# Altium schematic sheet 07_ZYNQ_CAMERALINK.SchDoc
size 420 x 296 mm; SheetNumber: 7; SheetTotal: 7
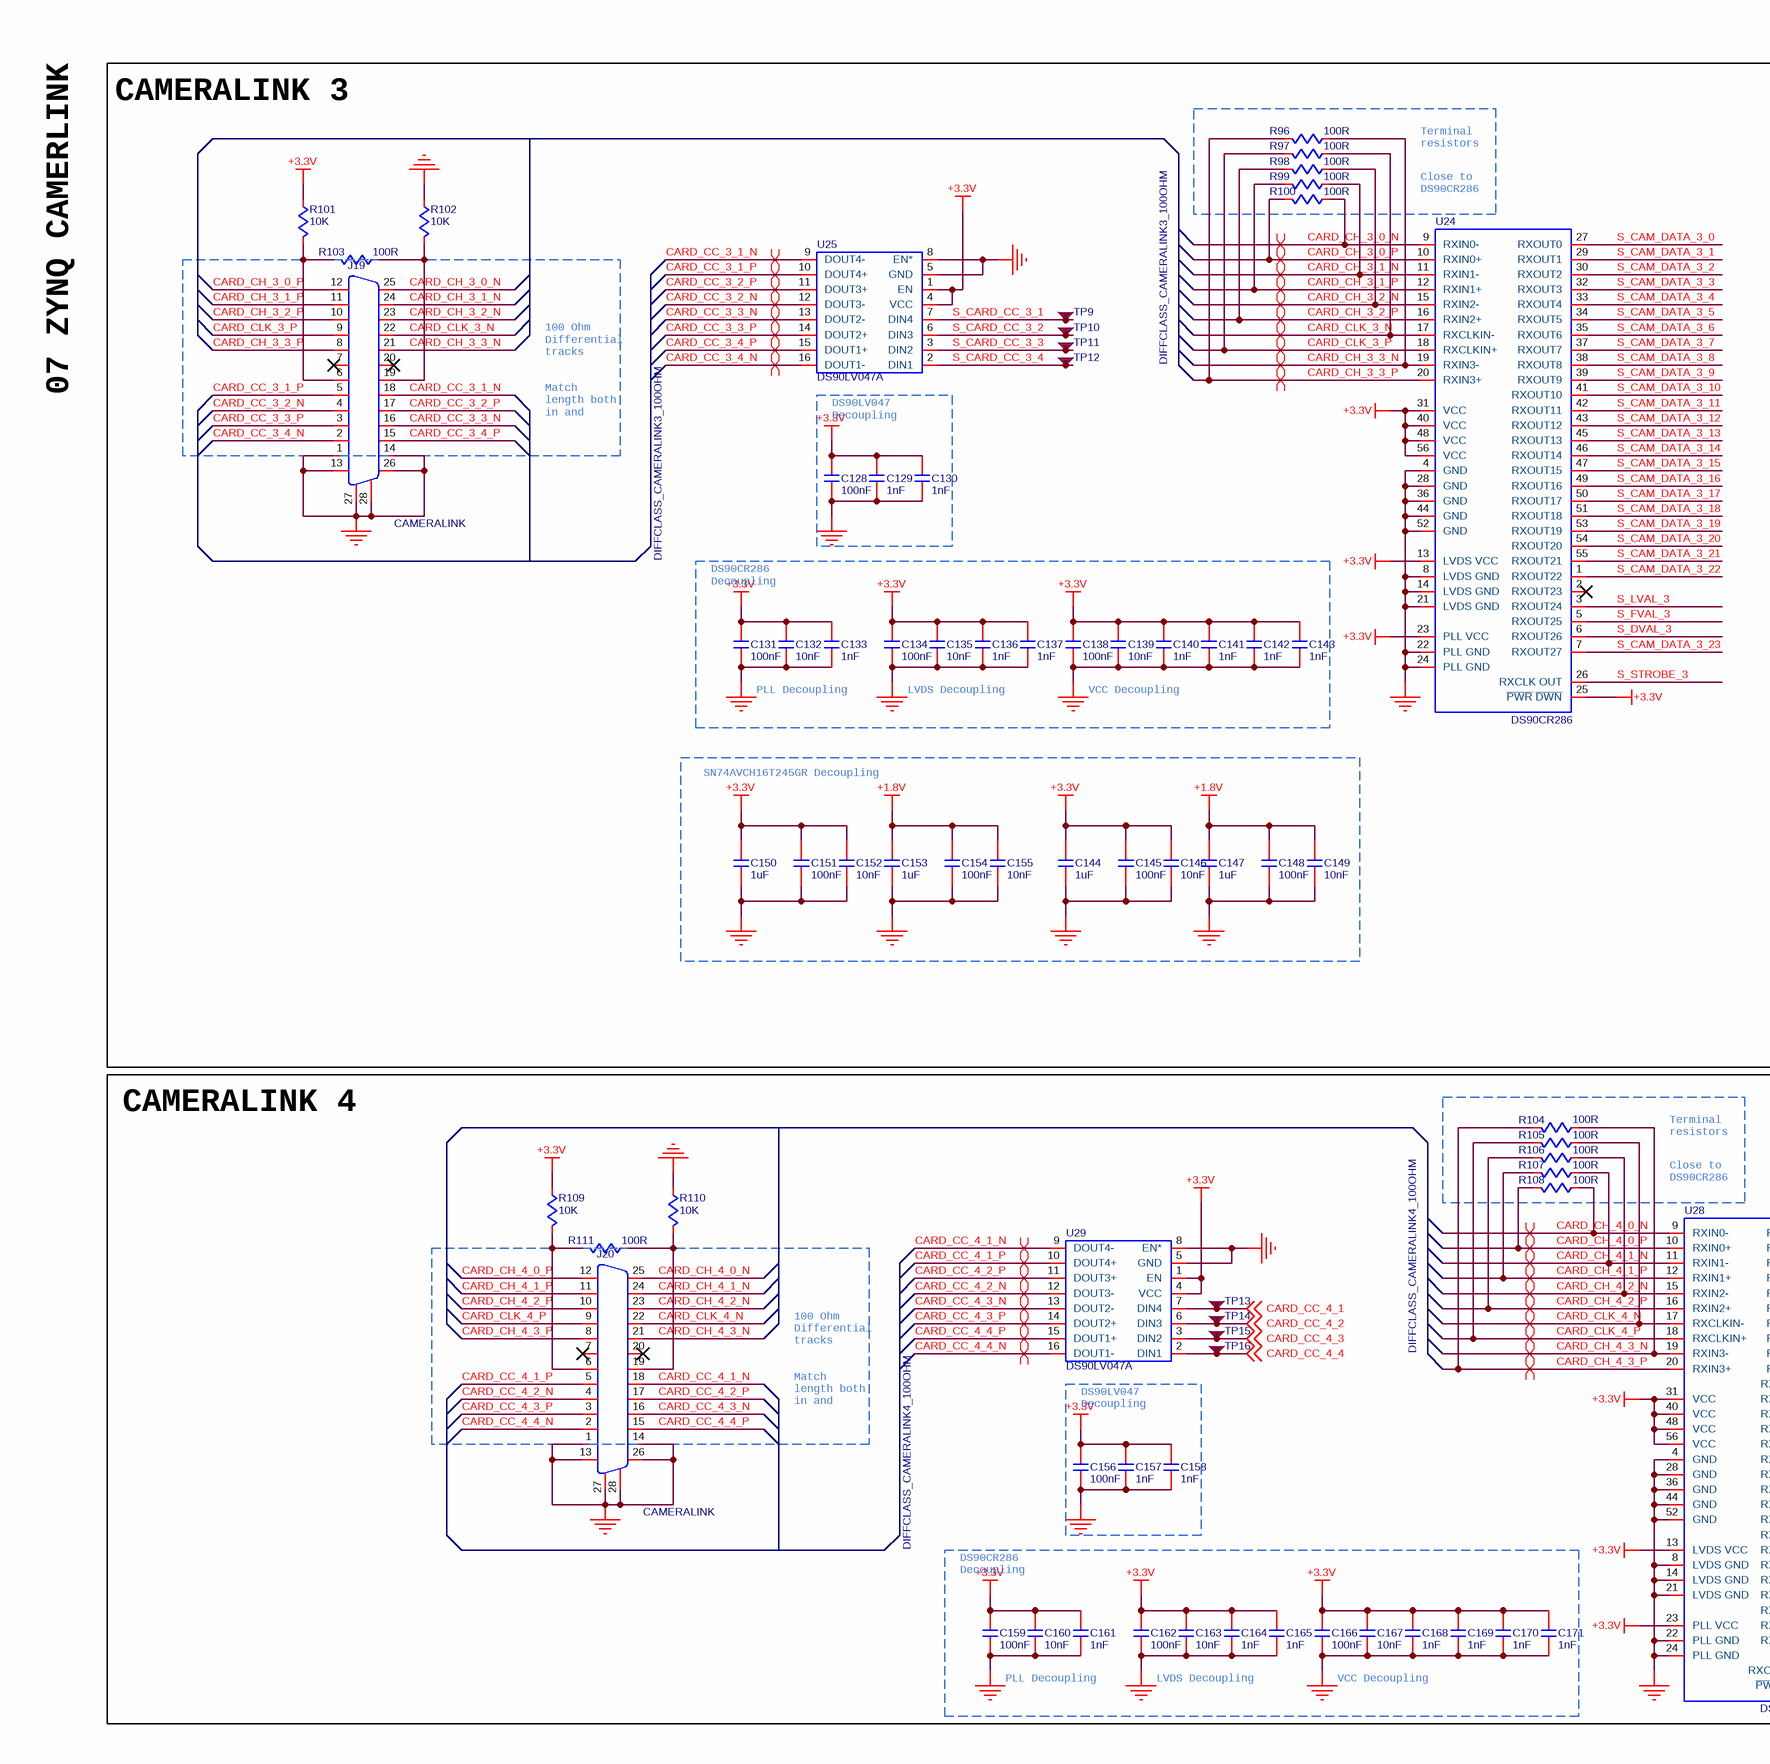
[diagram p0: 07_ZYNQ_CAMERALINK.SchDoc, left]
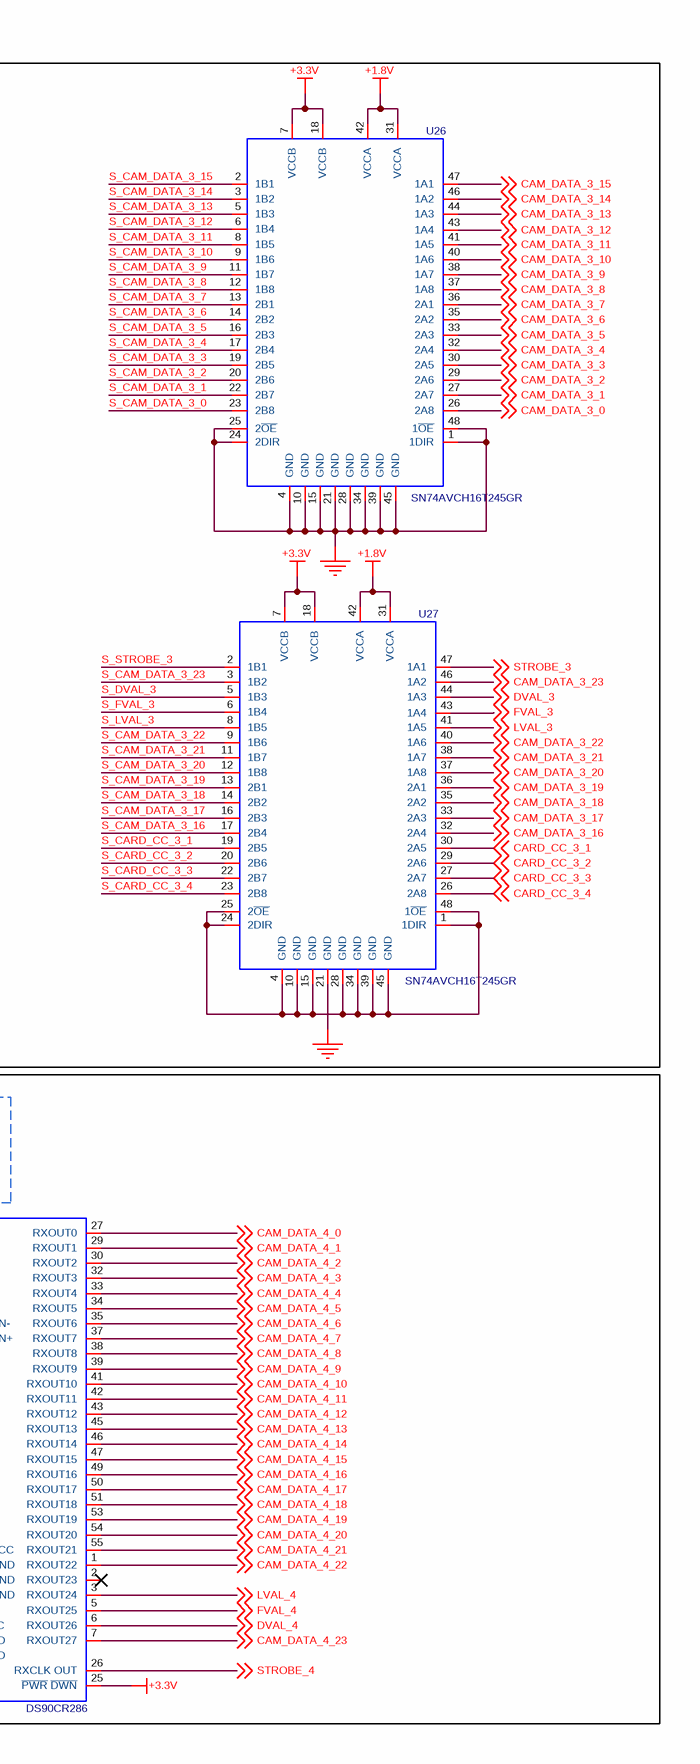
[diagram p1: 07_ZYNQ_CAMERALINK.SchDoc, right]

## Parts
C128  value 100nF  [C0402]  (hidden comment: C-NOMO)
C129  value 1nF  [C0402]  (hidden comment: C-NOMO)
C130  value 1nF  [C0402]  (hidden comment: C-NOMO)
C131  value 100nF  [C0402]  (hidden comment: C-NOMO)
C132  value 10nF  [C0402]  (hidden comment: C-NOMO)
C133  value 1nF  [C0402]  (hidden comment: C-NOMO)
C134  value 100nF  [C0402]  (hidden comment: C-NOMO)
C135  value 10nF  [C0402]  (hidden comment: C-NOMO)
C136  value 1nF  [C0402]  (hidden comment: C-NOMO)
C137  value 1nF  [C0402]  (hidden comment: C-NOMO)
C138  value 100nF  [C0402]  (hidden comment: C-NOMO)
C139  value 10nF  [C0402]  (hidden comment: C-NOMO)
C140  value 1nF  [C0402]  (hidden comment: C-NOMO)
C141  value 1nF  [C0402]  (hidden comment: C-NOMO)
C142  value 1nF  [C0402]  (hidden comment: C-NOMO)
C143  value 1nF  [C0402]  (hidden comment: C-NOMO)
C144  value 1uF  [C0402]  (hidden comment: C-NOMO)
C145  value 100nF  [C0402]  (hidden comment: C-NOMO)
C146  value 10nF  [C0402]  (hidden comment: C-NOMO)
C147  value 1uF  [C0402]  (hidden comment: C-NOMO)
C148  value 100nF  [C0402]  (hidden comment: C-NOMO)
C149  value 10nF  [C0402]  (hidden comment: C-NOMO)
C150  value 1uF  [C0402]  (hidden comment: C-NOMO)
C151  value 100nF  [C0402]  (hidden comment: C-NOMO)
C152  value 10nF  [C0402]  (hidden comment: C-NOMO)
C153  value 1uF  [C0402]  (hidden comment: C-NOMO)
C154  value 100nF  [C0402]  (hidden comment: C-NOMO)
C155  value 10nF  [C0402]  (hidden comment: C-NOMO)
C156  value 100nF  [C0402]  (hidden comment: C-NOMO)
C157  value 1nF  [C0402]  (hidden comment: C-NOMO)
C158  value 1nF  [C0402]  (hidden comment: C-NOMO)
C159  value 100nF  [C0402]  (hidden comment: C-NOMO)
C160  value 10nF  [C0402]  (hidden comment: C-NOMO)
C161  value 1nF  [C0402]  (hidden comment: C-NOMO)
C162  value 100nF  [C0402]  (hidden comment: C-NOMO)
C163  value 10nF  [C0402]  (hidden comment: C-NOMO)
C164  value 1nF  [C0402]  (hidden comment: C-NOMO)
C165  value 1nF  [C0402]  (hidden comment: C-NOMO)
C166  value 100nF  [C0402]  (hidden comment: C-NOMO)
C167  value 10nF  [C0402]  (hidden comment: C-NOMO)
C168  value 1nF  [C0402]  (hidden comment: C-NOMO)
C169  value 1nF  [C0402]  (hidden comment: C-NOMO)
C170  value 1nF  [C0402]  (hidden comment: C-NOMO)
C171  value 1nF  [C0402]  (hidden comment: C-NOMO)
J19  CAMERALINK  [CAMERALINK]
J20  CAMERALINK  [CAMERALINK]
R96  value 100R  [R0402]  (hidden comment: R)
R97  value 100R  [R0402]  (hidden comment: R)
R98  value 100R  [R0402]  (hidden comment: R)
R99  value 100R  [R0402]  (hidden comment: R)
R100  value 100R  [R0402]  (hidden comment: R)
R101  value 10K  [R0402]  (hidden comment: R)
R102  value 10K  [R0402]  (hidden comment: R)
R103  value 100R  [R0402]  (hidden comment: R)
R104  value 100R  [R0402]  (hidden comment: R)
R105  value 100R  [R0402]  (hidden comment: R)
R106  value 100R  [R0402]  (hidden comment: R)
R107  value 100R  [R0402]  (hidden comment: R)
R108  value 100R  [R0402]  (hidden comment: R)
R109  value 10K  [R0402]  (hidden comment: R)
R110  value 10K  [R0402]  (hidden comment: R)
R111  value 100R  [R0402]  (hidden comment: R)
TP9  TP  [TP]  (value not drawn)
TP10  TP  [TP]  (value not drawn)
TP11  TP  [TP]  (value not drawn)
TP12  TP  [TP]  (value not drawn)
TP13  TP  [TP]  (value not drawn)
TP14  TP  [TP]  (value not drawn)
TP15  TP  [TP]  (value not drawn)
TP16  TP  [TP]  (value not drawn)
U24  DS90CR286  [DS90CR286]
U25  DS90LV047A  [DS90LV047]
U26  SN74AVCH16T245GR  [SN74AVCH16T245GR]
U27  SN74AVCH16T245GR  [SN74AVCH16T245GR]
U28  DS90CR286  [DS90CR286]
U29  DS90LV047A  [DS90LV047]

## Blocks framed on the sheet
CAMERALINK 3: C128-C155 J19 R96-R103 TP9-TP12 U24-U27
CAMERALINK 4: C156-C171 J20 R104-R111 TP13-TP16 U28 U29

## Nets
+1.8V: C147.2 C148.2 C149.2 C153.2 C154.2 C155.2 U26.31(VCCA) U26.42(VCCA) U27.31(VCCA) U27.42(VCCA)
+3.3V: C128.2 C129.2 C130.2 C131.2 C132.2 C133.2 C134.2 C135.2 C136.2 C137.2 C138.2 C139.2 C140.2 C141.2 C142.2 C143.2 C144.2 C145.2 C146.2 C150.2 C151.2 C152.2 C156.2 C157.2 C158.2 C159.2 C160.2 C161.2 C162.2 C163.2 C164.2 C165.2 C166.2 C167.2 C168.2 C169.2 C170.2 C171.2 R101.2 R109.2 U24.13(LVDS_VCC) U24.23(PLL_VCC) U24.25(~{PWR}_~{DWN}) U24.31(VCC) U24.40(VCC) U24.48(VCC) U24.56(VCC) U25.1(EN) U25.4(VCC) U26.7(VCCB) U26.18(VCCB) U27.7(VCCB) U27.18(VCCB) U28.13(LVDS_VCC) U28.23(PLL_VCC) U28.25(~{PWR}_~{DWN}) U28.31(VCC) U28.40(VCC) U28.48(VCC) U28.56(VCC) U29.1(EN) U29.4(VCC)
GND: C128.1 C129.1 C130.1 C131.1 C132.1 C133.1 C134.1 C135.1 C136.1 C137.1 C138.1 C139.1 C140.1 C141.1 C142.1 C143.1 C144.1 C145.1 C146.1 C147.1 C148.1 C149.1 C150.1 C151.1 C152.1 C153.1 C154.1 C155.1 C156.1 C157.1 C158.1 C159.1 C160.1 C161.1 C162.1 C163.1 C164.1 C165.1 C166.1 C167.1 C168.1 C169.1 C170.1 C171.1 J19.1 J19.13 J19.14 J19.26 J19.27 J19.28 J20.1 J20.13 J20.14 J20.26 J20.27 J20.28 R102.2 R110.2 U24.4(GND) U24.8(LVDS_GND) U24.14(LVDS_GND) U24.21(LVDS_GND) U24.22(PLL_GND) U24.24(PLL_GND) U24.28(GND) U24.36(GND) U24.44(GND) U24.52(GND) U25.5(GND) U25.8(EN*) U26.1(1DIR) U26.4(GND) U26.10(GND) U26.15(GND) U26.21(GND) U26.24(2DIR) U26.25(2~{OE}) U26.28(GND) U26.34(GND) U26.39(GND) U26.45(GND) U26.48(1~{OE}) U27.21(GND) U28.4(GND) U28.8(LVDS_GND) U28.14(LVDS_GND) U28.21(LVDS_GND) U28.22(PLL_GND) U28.24(PLL_GND) U28.28(GND) U28.36(GND) U28.44(GND) U28.52(GND) U29.5(GND) U29.8(EN*)
CAM_DATA_3_0: U26.26(2A8) ; off-sheet CAM_DATA_3_0
CAM_DATA_3_1: U26.27(2A7) ; off-sheet CAM_DATA_3_1
CAM_DATA_3_2: U26.29(2A6) ; off-sheet CAM_DATA_3_2
CAM_DATA_3_3: U26.30(2A5) ; off-sheet CAM_DATA_3_3
CAM_DATA_3_4: U26.32(2A4) ; off-sheet CAM_DATA_3_4
CAM_DATA_3_5: U26.33(2A3) ; off-sheet CAM_DATA_3_5
CAM_DATA_3_6: U26.35(2A2) ; off-sheet CAM_DATA_3_6
CAM_DATA_3_7: U26.36(2A1) ; off-sheet CAM_DATA_3_7
CAM_DATA_3_8: U26.37(1A8) ; off-sheet CAM_DATA_3_8
CAM_DATA_3_9: U26.38(1A7) ; off-sheet CAM_DATA_3_9
CAM_DATA_3_10: U26.40(1A6) ; off-sheet CAM_DATA_3_10
CAM_DATA_3_11: U26.41(1A5) ; off-sheet CAM_DATA_3_11
CAM_DATA_3_12: U26.43(1A4) ; off-sheet CAM_DATA_3_12
CAM_DATA_3_13: U26.44(1A3) ; off-sheet CAM_DATA_3_13
CAM_DATA_3_14: U26.46(1A2) ; off-sheet CAM_DATA_3_14
CAM_DATA_3_15: U26.47(1A1) ; off-sheet CAM_DATA_3_15
CAM_DATA_3_16: U27.32(2A4) ; off-sheet CAM_DATA_3_16
CAM_DATA_3_17: U27.33(2A3) ; off-sheet CAM_DATA_3_17
CAM_DATA_3_18: U27.35(2A2) ; off-sheet CAM_DATA_3_18
CAM_DATA_3_19: U27.36(2A1) ; off-sheet CAM_DATA_3_19
CAM_DATA_3_20: U27.37(1A8) ; off-sheet CAM_DATA_3_20
CAM_DATA_3_21: U27.38(1A7) ; off-sheet CAM_DATA_3_21
CAM_DATA_3_22: U27.40(1A6) ; off-sheet CAM_DATA_3_22
CAM_DATA_3_23: U27.46(1A2) ; off-sheet CAM_DATA_3_23
CAM_DATA_4_0: U28.27(RXOUT0) ; off-sheet CAM_DATA_4_0
CAM_DATA_4_1: U28.29(RXOUT1) ; off-sheet CAM_DATA_4_1
CAM_DATA_4_2: U28.30(RXOUT2) ; off-sheet CAM_DATA_4_2
CAM_DATA_4_3: U28.32(RXOUT3) ; off-sheet CAM_DATA_4_3
CAM_DATA_4_4: U28.33(RXOUT4) ; off-sheet CAM_DATA_4_4
CAM_DATA_4_5: U28.34(RXOUT5) ; off-sheet CAM_DATA_4_5
CAM_DATA_4_6: U28.35(RXOUT6) ; off-sheet CAM_DATA_4_6
CAM_DATA_4_7: U28.37(RXOUT7) ; off-sheet CAM_DATA_4_7
CAM_DATA_4_8: U28.38(RXOUT8) ; off-sheet CAM_DATA_4_8
CAM_DATA_4_9: U28.39(RXOUT9) ; off-sheet CAM_DATA_4_9
CAM_DATA_4_10: U28.41(RXOUT10) ; off-sheet CAM_DATA_4_10
CAM_DATA_4_11: U28.42(RXOUT11) ; off-sheet CAM_DATA_4_11
CAM_DATA_4_12: U28.43(RXOUT12) ; off-sheet CAM_DATA_4_12
CAM_DATA_4_13: U28.45(RXOUT13) ; off-sheet CAM_DATA_4_13
CAM_DATA_4_14: U28.46(RXOUT14) ; off-sheet CAM_DATA_4_14
CAM_DATA_4_15: U28.47(RXOUT15) ; off-sheet CAM_DATA_4_15
CAM_DATA_4_16: U28.49(RXOUT16) ; off-sheet CAM_DATA_4_16
CAM_DATA_4_17: U28.50(RXOUT17) ; off-sheet CAM_DATA_4_17
CAM_DATA_4_18: U28.51(RXOUT18) ; off-sheet CAM_DATA_4_18
CAM_DATA_4_19: U28.53(RXOUT19) ; off-sheet CAM_DATA_4_19
CAM_DATA_4_20: U28.54(RXOUT20) ; off-sheet CAM_DATA_4_20
CAM_DATA_4_21: U28.55(RXOUT21) ; off-sheet CAM_DATA_4_21
CAM_DATA_4_22: U28.1(RXOUT22) ; off-sheet CAM_DATA_4_22
CAM_DATA_4_23: U28.7(RXOUT27) ; off-sheet CAM_DATA_4_23
CARD_CC_3_1: U27.30(2A5) ; off-sheet CARD_CC_3_1
CARD_CC_3_1_N: J19.18 U25.9(DOUT4-)
CARD_CC_3_1_P: J19.5 U25.10(DOUT4+)
CARD_CC_3_2: U27.29(2A6) ; off-sheet CARD_CC_3_2
CARD_CC_3_2_N: J19.4 U25.12(DOUT3-)
CARD_CC_3_2_P: J19.17 U25.11(DOUT3+)
CARD_CC_3_3: U27.27(2A7) ; off-sheet CARD_CC_3_3
CARD_CC_3_3_N: J19.16 U25.13(DOUT2-)
CARD_CC_3_3_P: J19.3 U25.14(DOUT2+)
CARD_CC_3_4: U27.26(2A8) ; off-sheet CARD_CC_3_4
CARD_CC_3_4_N: J19.2 U25.16(DOUT1-)
CARD_CC_3_4_P: J19.15 U25.15(DOUT1+)
CARD_CC_4_1: TP13.0 U29.7(DIN4) ; off-sheet CARD_CC_4_1
CARD_CC_4_1_N: J20.18 U29.9(DOUT4-)
CARD_CC_4_1_P: J20.5 U29.10(DOUT4+)
CARD_CC_4_2: TP14.0 U29.6(DIN3) ; off-sheet CARD_CC_4_2
CARD_CC_4_2_N: J20.4 U29.12(DOUT3-)
CARD_CC_4_2_P: J20.17 U29.11(DOUT3+)
CARD_CC_4_3: TP15.0 U29.3(DIN2) ; off-sheet CARD_CC_4_3
CARD_CC_4_3_N: J20.16 U29.13(DOUT2-)
CARD_CC_4_3_P: J20.3 U29.14(DOUT2+)
CARD_CC_4_4: TP16.0 U29.2(DIN1) ; off-sheet CARD_CC_4_4
CARD_CC_4_4_N: J20.2 U29.16(DOUT1-)
CARD_CC_4_4_P: J20.15 U29.15(DOUT1+)
CARD_CH_3_0_N: J19.25 R100.2 U24.9(RXIN0-)
CARD_CH_3_0_P: J19.12 R100.1 U24.10(RXIN0+)
CARD_CH_3_1_N: J19.24 R99.2 U24.11(RXIN1-)
CARD_CH_3_1_P: J19.11 R99.1 U24.12(RXIN1+)
CARD_CH_3_2_N: J19.23 R98.2 U24.15(RXIN2-)
CARD_CH_3_2_P: J19.10 R98.1 U24.16(RXIN2+)
CARD_CH_3_3_N: J19.21 R96.2 U24.19(RXIN3-)
CARD_CH_3_3_P: J19.8 R96.1 U24.20(RXIN3+)
CARD_CH_4_0_N: J20.25 R108.2 U28.9(RXIN0-)
CARD_CH_4_0_P: J20.12 R108.1 U28.10(RXIN0+)
CARD_CH_4_1_N: J20.24 R107.2 U28.11(RXIN1-)
CARD_CH_4_1_P: J20.11 R107.1 U28.12(RXIN1+)
CARD_CH_4_2_N: J20.23 R106.2 U28.15(RXIN2-)
CARD_CH_4_2_P: J20.10 R106.1 U28.16(RXIN2+)
CARD_CH_4_3_N: J20.21 R104.2 U28.19(RXIN3-)
CARD_CH_4_3_P: J20.8 R104.1 U28.20(RXIN3+)
CARD_CLK_3_N: J19.22 R97.2 U24.17(RXCLKIN-)
CARD_CLK_3_P: J19.9 R97.1 U24.18(RXCLKIN+)
CARD_CLK_4_N: J20.22 R105.2 U28.17(RXCLKIN-)
CARD_CLK_4_P: J20.9 R105.1 U28.18(RXCLKIN+)
DVAL_3: U27.44(1A3) ; off-sheet DVAL_3
DVAL_4: U28.6(RXOUT26) ; off-sheet DVAL_4
FVAL_3: U27.43(1A4) ; off-sheet FVAL_3
FVAL_4: U28.5(RXOUT25) ; off-sheet FVAL_4
LVAL_3: U27.41(1A5) ; off-sheet LVAL_3
LVAL_4: U28.3(RXOUT24) ; off-sheet LVAL_4
S_CAM_DATA_3_0: U24.27(RXOUT0) U26.23(2B8)
S_CAM_DATA_3_1: U24.29(RXOUT1) U26.22(2B7)
S_CAM_DATA_3_2: U24.30(RXOUT2) U26.20(2B6)
S_CAM_DATA_3_3: U24.32(RXOUT3) U26.19(2B5)
S_CAM_DATA_3_4: U24.33(RXOUT4) U26.17(2B4)
S_CAM_DATA_3_5: U24.34(RXOUT5) U26.16(2B3)
S_CAM_DATA_3_6: U24.35(RXOUT6) U26.14(2B2)
S_CAM_DATA_3_7: U24.37(RXOUT7) U26.13(2B1)
S_CAM_DATA_3_8: U24.38(RXOUT8) U26.12(1B8)
S_CAM_DATA_3_9: U24.39(RXOUT9) U26.11(1B7)
S_CAM_DATA_3_10: U24.41(RXOUT10) U26.9(1B6)
S_CAM_DATA_3_11: U24.42(RXOUT11) U26.8(1B5)
S_CAM_DATA_3_12: U24.43(RXOUT12) U26.6(1B4)
S_CAM_DATA_3_13: U24.45(RXOUT13) U26.5(1B3)
S_CAM_DATA_3_14: U24.46(RXOUT14) U26.3(1B2)
S_CAM_DATA_3_15: U24.47(RXOUT15) U26.2(1B1)
S_CAM_DATA_3_16: U24.49(RXOUT16) U27.17(2B4)
S_CAM_DATA_3_17: U24.50(RXOUT17) U27.16(2B3)
S_CAM_DATA_3_18: U24.51(RXOUT18) U27.14(2B2)
S_CAM_DATA_3_19: U24.53(RXOUT19) U27.13(2B1)
S_CAM_DATA_3_20: U24.54(RXOUT20) U27.12(1B8)
S_CAM_DATA_3_21: U24.55(RXOUT21) U27.11(1B7)
S_CAM_DATA_3_22: U24.1(RXOUT22) U27.9(1B6)
S_CAM_DATA_3_23: U24.7(RXOUT27) U27.3(1B2)
S_CARD_CC_3_1: TP9.0 U25.7(DIN4) U27.19(2B5)
S_CARD_CC_3_2: TP10.0 U25.6(DIN3) U27.20(2B6)
S_CARD_CC_3_3: TP11.0 U25.3(DIN2) U27.22(2B7)
S_CARD_CC_3_4: TP12.0 U25.2(DIN1) U27.23(2B8)
S_DVAL_3: U24.6(RXOUT26) U27.5(1B3)
S_FVAL_3: U24.5(RXOUT25) U27.6(1B4)
S_LVAL_3: U24.3(RXOUT24) U27.8(1B5)
S_STROBE_3: U24.26(RXCLK_OUT) U27.2(1B1)
STROBE_3: U27.47(1A1) ; off-sheet STROBE_3
STROBE_4: U28.26(RXCLK_OUT) ; off-sheet STROBE_4
NetJ19_6: J19.6 R101.1 R103.1
NetJ19_19: J19.19 R102.1 R103.2
NetJ20_6: J20.6 R109.1 R111.1
NetJ20_19: J20.19 R110.1 R111.2
NetU27_1: U27.1(1DIR) U27.4(GND) U27.10(GND) U27.15(GND) U27.24(2DIR) U27.25(2~{OE}) U27.28(GND) U27.34(GND) U27.39(GND) U27.45(GND) U27.48(1~{OE})

Not connected (* = marked no-connect by the designer): J19 7* 20*; J20 7* 20*; U24 2(RXOUT23)*; U28 2(RXOUT23)*

## Layout directives
differential pair; differential pair class DIFFCLASS_CAMERALINK4_100OHM: CARD_CC_4_1_N, CARD_CC_4_1_P, CARD_CC_4_2_N, CARD_CC_4_2_P, CARD_CC_4_3_N, CARD_CC_4_3_P, CARD_CC_4_4_N, CARD_CC_4_4_P, CARD_CH_4_0_N, CARD_CH_4_0_P, CARD_CH_4_1_N, CARD_CH_4_1_P, CARD_CH_4_2_N, CARD_CH_4_2_P, CARD_CH_4_3_N, CARD_CH_4_3_P, CARD_CLK_4_N, CARD_CLK_4_P
differential pair; differential pair class DIFFCLASS_CAMERALINK3_100OHM: CARD_CC_3_1_N, CARD_CC_3_1_P, CARD_CC_3_2_N, CARD_CC_3_2_P, CARD_CC_3_3_N, CARD_CC_3_3_P, CARD_CC_3_4_N, CARD_CC_3_4_P, CARD_CH_3_0_N, CARD_CH_3_0_P, CARD_CH_3_1_N, CARD_CH_3_1_P, CARD_CH_3_2_N, CARD_CH_3_2_P, CARD_CH_3_3_N, CARD_CH_3_3_P, CARD_CLK_3_N, CARD_CLK_3_P

## Notes on the sheet
- Terminal resistors
- (near U24) Close to DS90CR286
- 07 ZYNQ CAMERLINK
- 100 Ohm Differential tracks
  Match length both in and between pairs
- DS90LV047 Decoupling
- DS90CR286 Decoupling
- PLL Decoupling
- LVDS Decoupling
- VCC Decoupling
- SN74AVCH16T245GR Decoupling
- (near U28) Close to DS90CR286

## Library data of the parts
C128-C171 = C-NOMO: voltage: 25V; precision: 5%
R96-R111 = R: precision: 1%